# EAGLE design MainBoard 1.3.1 (EAGLE 8.4.1)
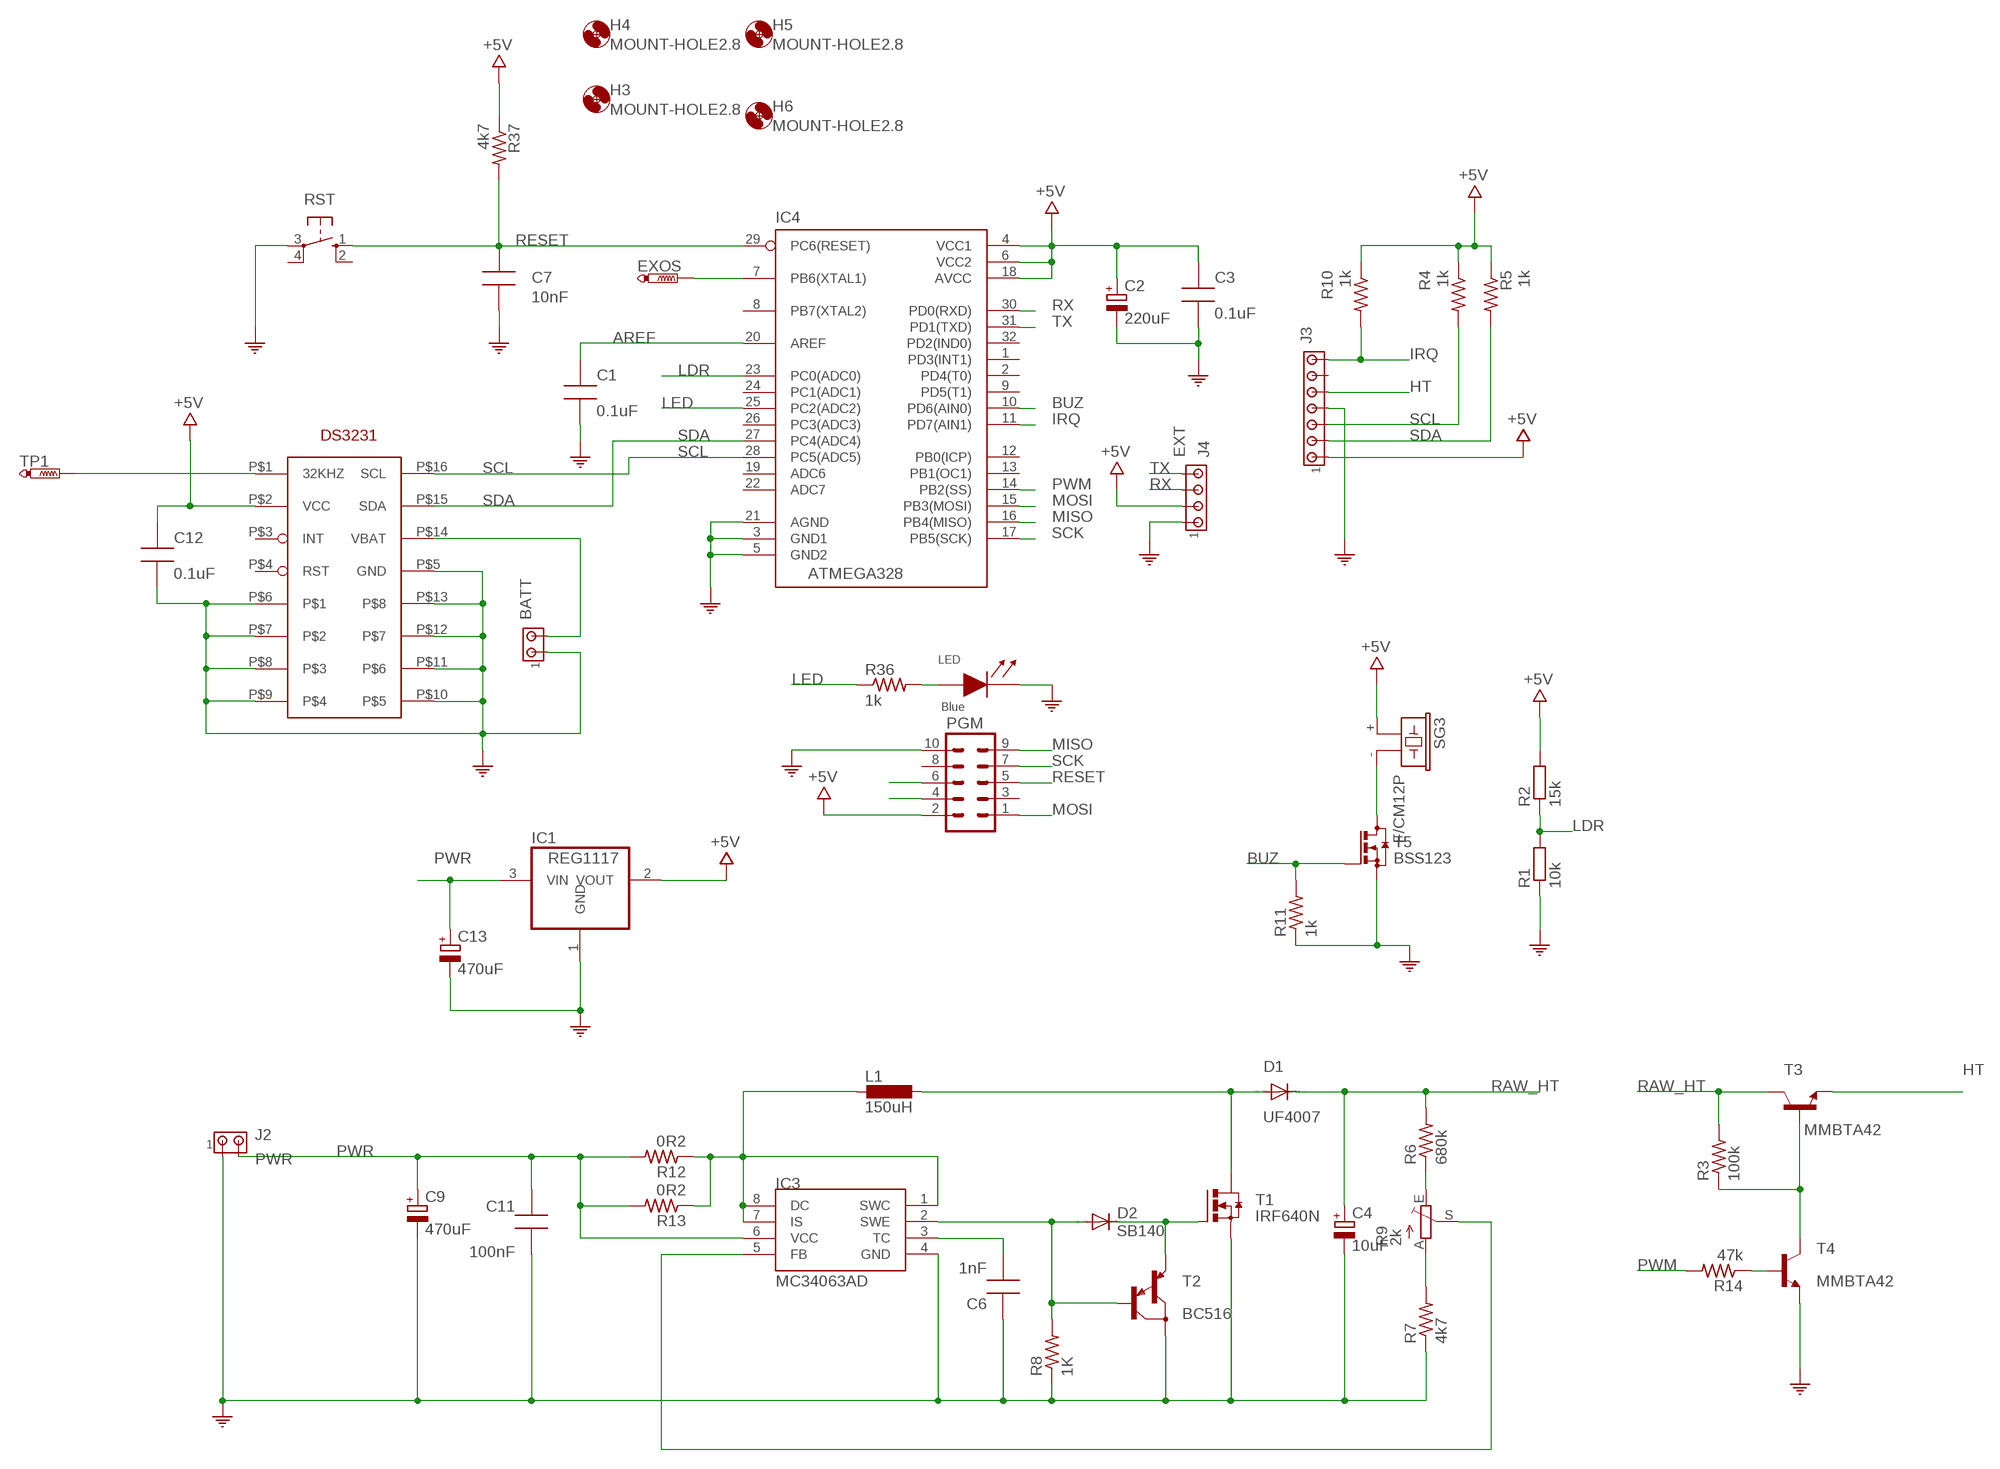
[diagram p0: schematic, sheet 1]

## Parts
BATT  MTA02-100  [10X02MTA]
C1  0.1uF  CAP0805-NP  [CAP0805-NP]
C2  220uF  CPOL-EUSMCD  [SMC_D]
C3  0.1uF  CAP0805-NP  [CAP0805-NP]
C4  10uF  CPOL-EUE3.5-10  [E3,5-10]
C6  1nF  CAP0805-NP  [CAP0805-NP]
C7  10nF  CAP0805-NP  [CAP0805-NP]
C9  470uF  CPOL-EUSMCD  [SMC_D]
C11  100nF  CAP0805-NP  [CAP0805-NP]
C12  0.1uF  CAP0805-NP  [CAP0805-NP]
C13  470uF  CPOL-EUSMCD  [SMC_D]
D1  UF4007  BYT01  [F126-10]
D2  SB140  DIODE-DO07  [DO07]
EXOS  PTR1TP09R  [TP09R]
H3  MOUNT-HOLE2.8  [2,8]
H4  MOUNT-HOLE2.8  [2,8]
H5  MOUNT-HOLE2.8  [2,8]
H6  MOUNT-HOLE2.8  [2,8]
IC1  REG1117  [SOT223]
IC3  MC34063AD  [SOIC8]
IC4  ATMEGA328  ATMEGA168-20AU  [QFP032]
IC5  DS3231SPIC16W  [SOIC-16W]
J2  PWR  MTA02-100  [10X02MTA]
J3  MTA07-100  [10X07MTA]
J4  EXT  MTA04-100  [10X04MTA]
L1  150uH  DO3316P  [D0522P]
LED  Blue  LED0805  [LED0805]
PGM  MA05-2  [MA05-2]
R1  10k  R-EU_M2012  [M2012]
R2  15k  R-EU_0204/2V  [0204V]
R3  100k  R-US_R2012  [R2012]
R4  1k  R-US_M2012  [M2012]
R5  1k  R-US_M2012  [M2012]
R6  680k  R-US_R2012  [R2012]
R7  4k7  R-US_R2012  [R2012]
R8  1K  R-US_R2012  [R2012]
R9  2k  TRIM_EU-B25P  [B25P]
R10  1k  R-US_M2012  [M2012]
R11  1k  R-US_M2012  [M2012]
R12  0R2  R-US_R2010  [R2010]
R13  0R2  R-US_R2010  [R2010]
R14  47k  R-US_R2012  [R2012]
R36  1k  R-US_M2012  [M2012]
R37  4k7  R-US_M2012  [M2012]
RST  10-XX  [B3F-10XX]
SG3  F/CM12P  [F/CM12P]
T1  IRF640N  IRF3704S  [D2PACK]
T2  BC516  [TO92]
T3  MMBTA42  BC846  [SOT23]
T4  MMBTA42  BC846  [SOT23]
T5  BSS123  [SOT23]
TP1  PTR1TP09R  [TP09R]

## Nets
+5V [pwr]: C2.+ C3.1 C12.1 IC1.2(VOUT) IC4.4(VCC1) IC4.6(VCC2) IC4.18(AVCC) IC5.P$2(VCC) J3.1 J4.2 PGM.2 R2.2 R4.1 R5.1 R10.1 R37.1 SG3.+
AREF: C1.1 IC4.20(AREF)
BATT: BATT.2 IC5.P$14(VBAT)
BUZ: IC4.10(PD6(AIN0)) R11.2 T5.1(G)
GND: BATT.1 C1.2 C2.- C3.2 C4.- C6.1 C7.2 C9.- C11.1 C12.2 C13.- IC1.1(GND) IC3.4(GND) IC4.3(GND1) IC4.5(GND2) IC4.21(AGND) IC5.P$5(GND) IC5.P$6 IC5.P$7 IC5.P$8 IC5.P$9 IC5.P$10 IC5.P$11 IC5.P$12 IC5.P$13 J2.1 J3.4 J4.1 LED.1(CA) PGM.10 R1.1 R7.1 R8.1 R11.1 RST.3(P) T1.3(S) T2.3(C) T4.2(E) T5.2(S) ; supply symbol labelled COM
HT: J3.5 T3.2(E)
IRQ: IC4.11(PD7(AIN1)) J3.7 R10.2
LDR: IC4.23(PC0(ADC0)) R1.2 R2.1
LED: IC4.25(PC2(ADC2)) R36.1
MISO: IC4.16(PB4(MISO)) PGM.9
MOSI: IC4.15(PB3(MOSI)) PGM.1
N$1: IC5.P$1(32KHZ) TP1.TP
N$2: D1.A L1.P$2 T1.2(D)
N$3: SG3.- T5.3(D)
N$5: EXOS.TP IC4.7(PB6(XTAL1))
N$6: C6.2 IC3.3(TC)
N$7: R3.1 T3.1(B) T4.3(C)
N$9: R7.2 R9.A
N$10: D2.A IC3.2(SWE) R8.2 T2.2(B)
N$11: R6.1 R9.E
N$15: LED.2(AN) R36.2
N$16: IC3.5(FB) R9.S
N$17: IC3.1(SWC) IC3.7(IS) IC3.8(DC) L1.P$1 R12.1 R13.1
N$19: R14.1 T4.1(B)
N$21: D2.C T1.1(G) T2.1(E)
PWM: IC4.14(PB2(SS)) R14.2
PWR [pwr]: C9.+ C11.2 C13.+ IC1.3(VIN) IC3.6(VCC) J2.2 R12.2 R13.2
RAW_HT: C4.+ D1.C R3.2 R6.2 T3.3(C)
RESET: C7.1 IC4.29(PC6(RESET)) PGM.5 R37.2 RST.1(S)
RX: IC4.30(PD0(RXD)) J4.3 PGM.4
SCK: IC4.17(PB5(SCK)) PGM.7
SCL: IC4.28(PC5(ADC5)) IC5.P$16(SCL) J3.3 R4.2
SDA: IC4.27(PC4(ADC4)) IC5.P$15(SDA) J3.2 R5.2
TX: IC4.31(PD1(TXD)) J4.4 PGM.6
Unconnected: IC4.1(PD3(INT1)) IC4.2(PD4(T0)) IC4.8(PB7(XTAL2)) IC4.9(PD5(T1)) IC4.12(PB0(ICP)) IC4.13(PB1(OC1)) IC4.19(ADC6) IC4.22(ADC7) IC4.24(PC1(ADC1)) IC4.26(PC3(ADC3)) IC4.32(PD2(IND0)) IC5.P$3(INT) IC5.P$4(RST) J3.6 PGM.3 PGM.8 RST.2(S1) RST.4(P1)

## Library data of the parts
BATT J2 = con-amp:MTA02-100: AMP connector
C1 C3 C6 C7 C11 C12 = MySMD:CAP0805-NP
C2 C9 C13 = rcl:CPOL-EU: POLARIZED CAPACITOR, European symbol
C4 = resistor:CPOL-EU: POLARIZED CAPACITOR, European symbol
D1 = diode:BYT01: DIODE ultra fast
D2 = diode:DIODE-: DIODE
EXOS TP1 = testpad:PTR1: TEST PIN
H3-H6 = holes:MOUNT-HOLE: MOUNTING HOLE with drill center marker
IC1 = burr-brown:REG1117: 800mA and 1A Low Dropout (LDO) Positive Regulator 1.8V, 2.5V, 2.85V, 3.3V, 5V, and Adj; MPN: REG1117; OC_FARNELL: 1097566; OC_NEWARK: 14P6981
IC3 = mc34063:MC34063
IC4 = MySMD:ATMEGA168-20AU
IC5 = DS3231:DS3231
J3 = con-amp:MTA07-100: AMP connector
J4 = con-amp:MTA04-100: AMP connector
L1 = inductor-coilcraft:DO3316P: COILCRAFT
LED = MySMD:LED0805
PGM = con-lstb:MA05-2: PIN HEADER; OC_FARNELL: unknown; OC_NEWARK: unknown
R1 R2 = resistor:R-EU_: RESISTOR, European symbol
R3-R8 R10-R14 R36 R37 = adafruit:R-US_: RESISTOR, American symbol
R9 = pot:TRIM_EU-: POTENTIOMETER
RST = switch-omron:10-XX: OMRON SWITCH; MPN: B3F-1000; OC_FARNELL: 176432; OC_NEWARK: 36M3542
SG3 = buzzer:F/CM12P: BUZZER Source: Buerklin; OC_FARNELL: unknown; OC_NEWARK: unknown
T1 = transistor-power:IRF3704: SMPS MOSFET HEXFET® Power MOSFET Source: http://www.irf.com/product-info/datasheets/data/irf3704.pdf
T2 = transistor-pnp:BC516: PNP Darlington Transistor
T3 T4 = transistor:BC846: NPN TRANSISTOR
T5 = transistor-small-signal:BSS123: N-CHANNEL MOS FET

## Module TUBEIN16
Ports: 

### Library data of the parts

## Net classes
0 default: width 0.254 mm, clearance 0.254 mm
1 pwr: width 0.254 mm, clearance 0.356 mm

## Board
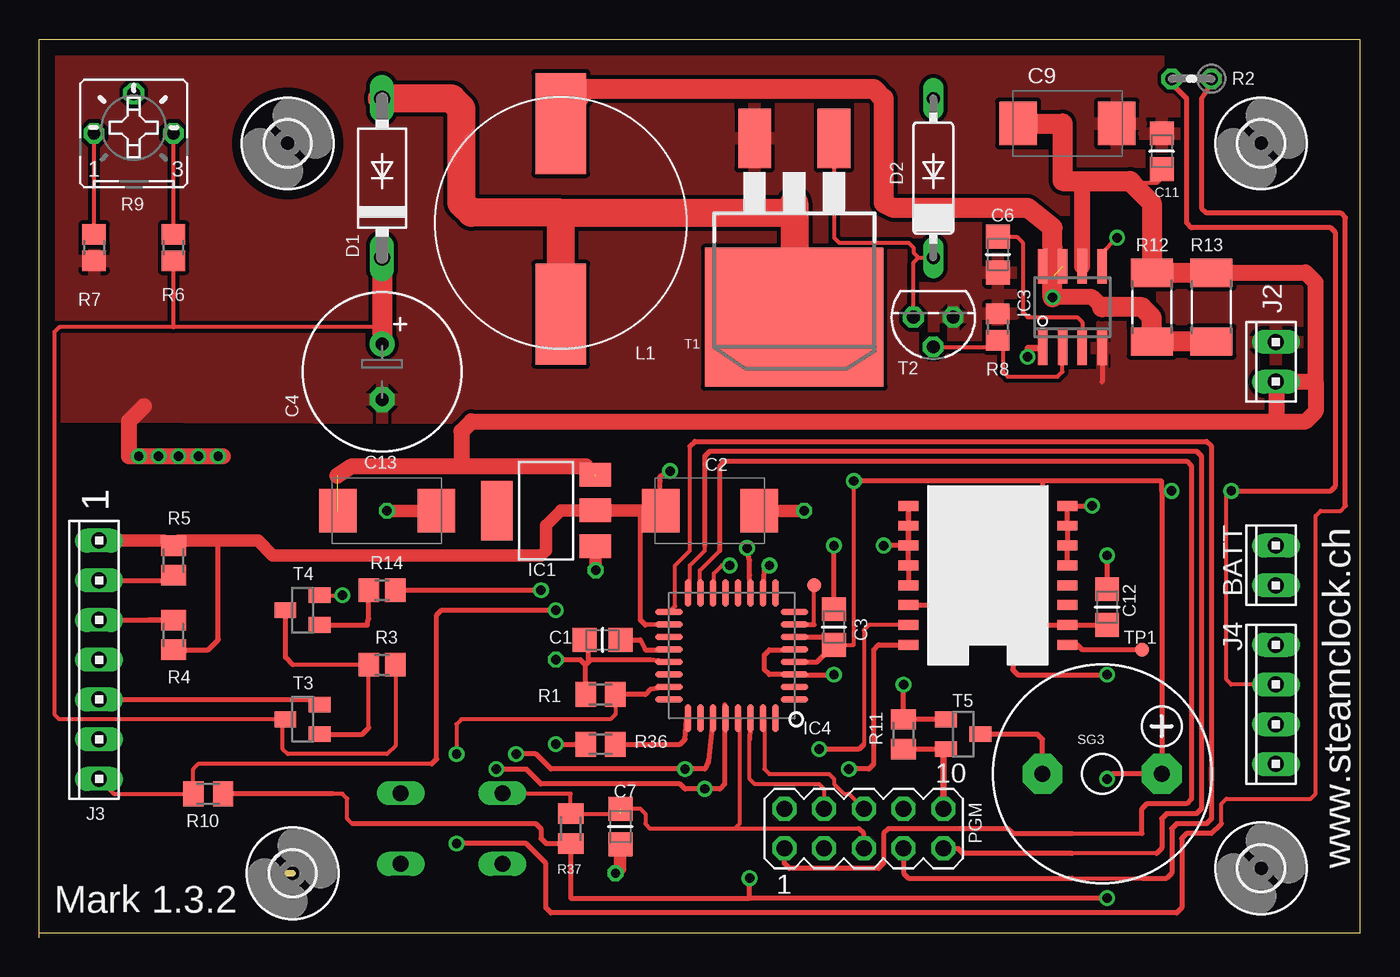
[diagram p1: board, top side]
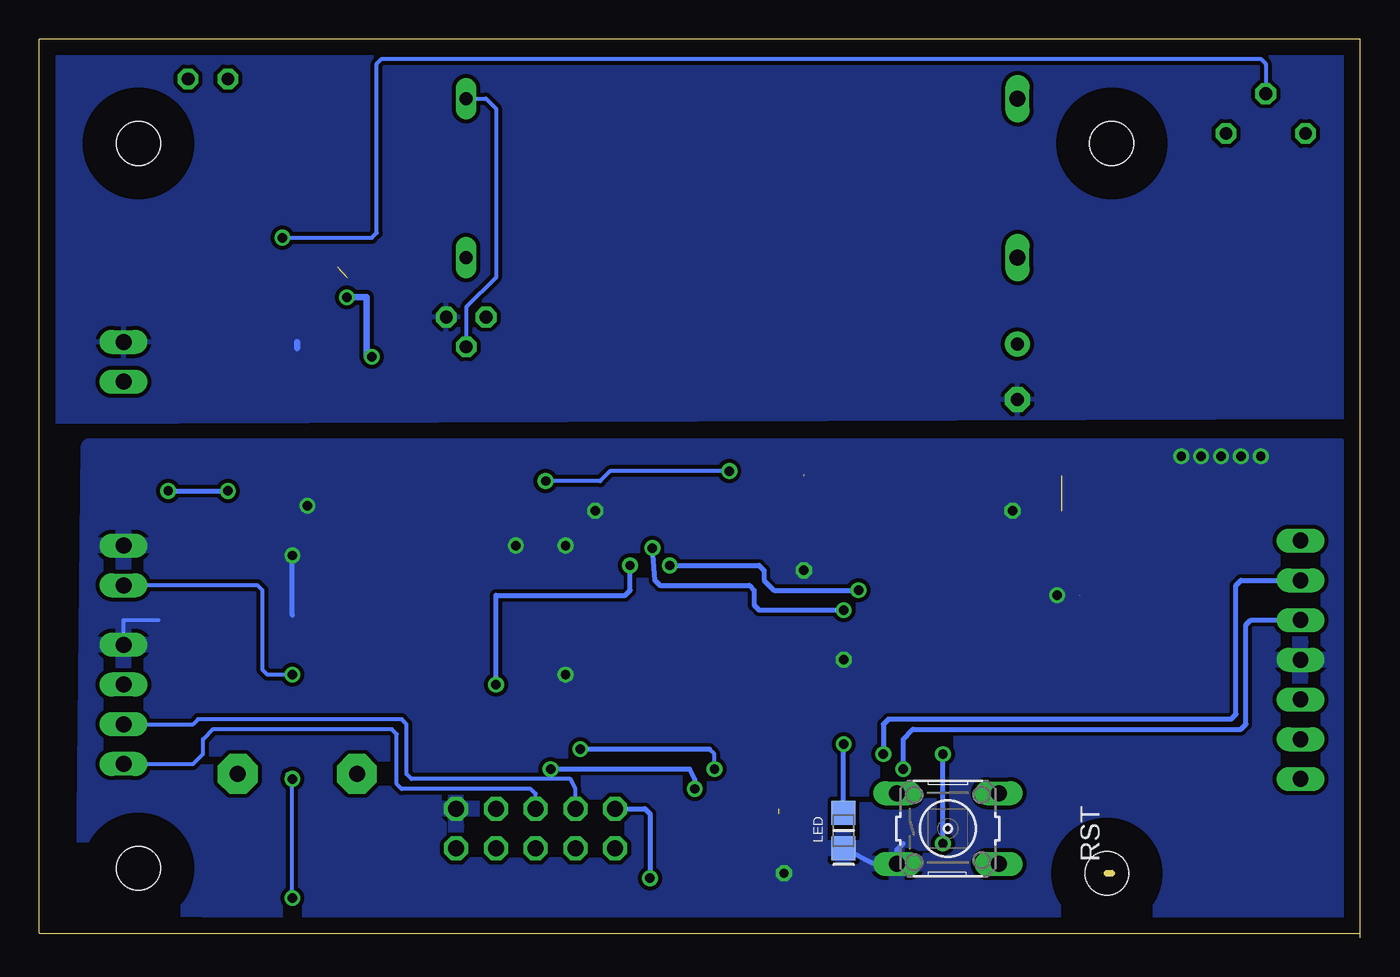
[diagram p2: board, bottom side, seen from below]

Size 84.47 x 57.47 mm. Coordinates in mm from the lower left corner, seen from the top.
Outline: 84.45,0.32 84.45,57.46
Outline: 84.45,0.3 0.02,0.3
Outline: 0,0 0,57.46
Outline: 16.21,4.13 15.89,4.13
Outline: 0.02,57.47 84.47,57.47
Copper layers (1*16): Top 0.035mm / dielectric 1.5mm / Bottom 0.035mm
Design rules "default": minimum track width 10mil, minimum drill 24mil, track to track 8mil, track to pad 8mil, pad to pad 8mil, via to via 8mil, smd to smd 8mil, copper to edge 40mil, drill to drill 8mil, minimum pad ring 10mil, minimum via ring 8mil, stop-mask expansion 4mil, vias tented up to drill 0mil, thermal gap 10mil

### Footprints (pad centres in the part's own frame; a part is rotated, then mirrored left to right if it is on the bottom)
10X02MTA = drill 1.016 long: 1 1.27,0; 2 -1.27,0
CAP0805-NP = smd 1.524 x 1.524: 1 0,0; 2 2.286,0
SMC_D = smd 2.4 x 2.8: + -3.15,0; - 3.15,0
E3,5-10 = drill 0.813 pad 1.6: + -1.778,0 | drill 0.813 pad 1.6 octagon: - 1.778,0
F126-10 = drill 1.016 long: A 5.08,0; C -5.08,0
DO07 = drill 0.813 long: A 5.08,0; C -5.08,0
TP09R = smd 0.9 x 0.9: TP 0,0
2,8 = hole 2.8: 0,0
SOT223 = smd 1.499 x 2.007: 1 -2.261,-3.15; 2 0.025,-3.15; 3 2.311,-3.15 | smd 3.81 x 2.007: 4 0,3.15
SOIC8 = smd 0.6 x 2.2: 1 -1.905,-2.6; 2 -0.635,-2.6; 3 0.635,-2.6; 4 1.905,-2.6; 5 1.905,2.6; 6 0.635,2.6; 7 -0.635,2.6; 8 -1.905,2.6
QFP032 = smd 0.432 x 1.778: 1 0,0; 2 0.8,0; 3 1.599,0; 4 2.399,0; 5 3.199,0; 6 3.998,0; 7 4.798,0; 8 5.598,0; 17 5.588,8.001; 18 4.798,7.997; 19 3.998,7.997; 20 3.199,7.997; 21 2.399,7.997; 22 1.599,7.997; 23 0.799,7.997; 24 0,7.997 | smd 1.778 x 0.432: 9 6.807,1.194; 10 6.807,2.007; 11 6.807,2.794; 12 6.807,3.607; 13 6.807,4.394; 14 6.807,5.182; 15 6.807,5.994; 16 6.816,6.803; 25 -1.194,6.807; 26 -1.194,5.994; 27 -1.194,5.182; 28 -1.194,4.394; 29 -1.194,3.607; 30 -1.194,2.794; 31 -1.194,2.007; 32 -1.194,1.194
SOIC-16W = smd 0.635 x 1.27: P$1 -16.51,-1.27; P$2 -15.24,-1.27; P$3 -13.97,-1.27; P$4 -12.7,-1.27; P$5 -11.43,-1.27; P$6 -10.16,-1.27; P$7 -8.89,-1.27; P$8 -7.62,-1.27; P$9 -7.62,8.89; P$10 -8.89,8.89; P$11 -10.16,8.89; P$12 -11.43,8.89; P$13 -12.7,8.89; P$14 -13.97,8.89; P$15 -15.24,8.89; P$16 -16.51,8.89
10X07MTA = drill 1.016 long: 1 7.62,0; 2 5.08,0; 3 2.54,0; 4 0,0; 5 -2.54,0; 6 -5.08,0; 7 -7.62,0
10X04MTA = drill 1.016 long: 1 3.81,0; 2 1.27,0; 3 -1.27,0; 4 -3.81,0
D0522P = smd 3.251 x 6.452: P$1 0,6.35; P$2 0,-5.842
LED0805 = smd 1.524 x 1.524: 1 0,0; 2 2.286,0
MA05-2 = drill 1.016 octagon: 1 -5.08,-1.27; 2 -5.08,1.27; 3 -2.54,-1.27; 4 -2.54,1.27; 5 0,-1.27; 6 0,1.27; 7 2.54,-1.27; 8 2.54,1.27; 9 5.08,-1.27; 10 5.08,1.27
M2012 = smd 1.3 x 1.6: 1 -0.95,0; 2 0.95,0
0204V = drill 0.813 octagon: 1 -1.27,0; 2 1.27,0
R2012 = smd 1.3 x 1.5: 1 -0.85,0; 2 0.85,0
B25P = drill 0.813 octagon: A -2.54,0; E 2.54,0; S 0,2.54
R2010 = smd 1.8 x 2.7: 1 -2.2,0; 2 2.2,0
B3F-10XX = drill 1.016 long: 1 -3.251,2.261; 2 3.251,2.261; 3 -3.251,-2.261; 4 3.251,-2.261
F/CM12P = drill 1.016 pad 2.54 octagon: + 3.81,0; - -3.81,0
D2PACK = smd 2.083 x 3.81: 1 -2.54,-8.89; 3 2.54,-8.89 | smd 11.43 x 8.89: 2 0,2.54
TO92 = drill 0.813 octagon: 1 1.27,0; 2 0,1.905; 3 -1.27,0
SOT23 = smd 1 x 1.4: 1 -0.95,-1.1; 2 0.95,-1.1; 3 0,1.1

### Placement (x,y rotation side)
BATT  79.08,23.81 90 top
C1  37.17,19.05 180 top
C2  42.88,27.3 0 top
C3  50.82,18.73 90 top
C4  21.93,36.2 270 top
C6  61.3,42.55 90 top
C7  37.17,8.26 270 top
C9  65.74,52.07 0 top
C11  71.77,51.44 270 top
C12  68.28,20 90 top
C13  22.25,27.3 0 top
D1  21.93,48.58 90 top
D2  57.17,48.58 90 top
EXOS  49.55,22.54 0 top
H3  15.89,50.8 0 top
H4  16.21,4.13 0 top
H5  78.12,4.45 0 top
H6  78.12,50.8 0 top
IC1  32.41,27.3 90 top
IC3  66.06,40.32 0 top
IC4  48.28,15.24 90 top
IC5  64.47,35.24 90 top
J2  79.08,36.83 90 top
J3  3.83,17.78 90 top
J4  79.08,14.92 90 top
L1  33.36,45.72 0 top
LED  33.04,5.71 90 bottom
PGM  52.73,6.99 0 top
R1  35.9,15.56 0 top
R2  73.68,54.93 180 top
R3  21.93,17.46 0 top
R4  8.59,19.37 90 top
R5  8.59,24.13 270 top
R6  8.59,44.13 270 top
R7  3.51,44.13 90 top
R8  61.3,39.05 270 top
R9  6.05,51.44 0 top
R10  10.81,9.21 180 top
R11  55.27,13.02 90 top
R12  71.14,40.32 90 top
R13  74.95,40.32 90 top
R14  21.93,22.22 0 top
R36  35.9,12.38 180 top
R37  33.99,6.99 90 top
RST  26.37,6.99 0 bottom
SG3  67.96,10.48 0 top
T1  48.28,42.23 180 top
T2  57.17,39.69 180 top
T3  16.85,13.97 90 top
T4  16.85,20.95 90 top
T5  59.08,13.02 270 top
TP1  70.5,18.41 180 top

### Tracks (layer width: path | path; a pad name or v marks a point on that pad's centre or on a via)
+5V  (via drill 0.6)
  Top 0.254: C3.1 52.09,18.73 v52.09,29.21 | 20.02,7.3 19.7,7.62 19.7,8.89 19.39,9.21 18.75,9.21 | J4.2 76.22,16.19 75.9,16.51 75.9,28.26 v76.22,28.58
  Top 0.305: 47.99,19.21 IC4.6 50.31,19.24 C3.1 49.73,17.64 IC4.4 | 64.16,29.21 64.16,20.32 64.47,20 IC5.P$2 C12.1 | 64.16,29.21 71.77,29.21 71.77,28.58 | 64.16,29.21 v52.09,29.21 | v68.28,2.54 45.42,2.54 | C2.+ 39.71,29.21 39.71,29.53 v40.34,29.84 | IC4.18 38.76,20 38.44,20.32 38.44,26.67 38.43,27.28 | 71.77,28.58 SG3.+ 68.6,10.48 v68.28,10.16 | v72.41,28.58 71.77,28.58 | 45.42,2.54 v45.42,3.81 | 45.42,2.54 33.99,2.54 R37.1 32.41,6.03 32.09,6.35 32.09,6.99 31.77,7.3 20.02,7.3 | 18.75,9.21 R10.1 | R2.2 72.41,54.61 73.36,53.66 73.36,45.72 73.68,45.4 82.57,45.4 82.89,45.08 82.89,28.89 82.57,28.58 v76.22,28.58 | 7.96,25.4 8.28,25.08 R5.1 | R4.1 10.81,18.42 11.45,19.05 11.45,25.4
  Top 0.406: 37.49,27.28 38.43,27.28 C2.+ | 35.53,27.31 IC1.2 | 8.28,18.42 8.27,18.42 R4.1
  Top 0.813: C2.+ 39.73,27.33 IC1.2 33.38,27.33 32.41,26.35 32.41,24.77 32.09,24.45 14.94,24.45 13.99,25.4 11.45,25.4 8.91,25.4 R5.1 | J3.1 7.96,25.4
  Bottom 0.254: v40.34,29.84 47.96,29.84 48.6,29.21 v52.09,29.21 | v68.28,2.54 v68.28,10.16 68.6,10.48
  Bottom 0.305: v76.22,28.58 v72.41,28.58 | PGM.2 45.74,8.26 45.42,7.94 v45.42,3.81
AREF
  Top 0.305: C1.1 38.44,19.05 38.76,18.42 40.26,18.42 IC4.20
BATT  (via drill 0.6)
  Top 0.305: IC5.P$14 61.93,21.27 62.25,20.95 62.25,17.15 62.57,16.83 v68.28,16.83
  Bottom 0.254: v68.28,16.83 69.87,16.83 70.19,17.15 70.19,22.22 70.5,22.54 BATT.2
BUZ  (via drill 0.6)
  Top 0.305: IC4.10 46.38,23.49 v46.69,23.81 | T5.1 R11.2 v55.27,16.19
  Bottom 0.305: v55.27,16.19 55.27,21.91 47.01,21.91 46.69,22.22 v46.69,23.81
GND  (via drill 0.6)  (1 unrouted)
  Top 0.254: C7.2 37.13,5.97 37.13,5.67 | 17.8,21.91 T4.2 | T4.2 v19.39,21.91
  Top 0.305: IC5.P$13 IC5.P$12 IC5.P$11 | IC5.P$11 IC5.P$10 IC5.P$9 IC5.P$11 | IC4.5 48.26,18.42 46.69,18.42 46.38,18.1 46.38,17.15 46.68,16.84 IC4.3 48.29,16.83 v50.82,16.83 | IC5.P$5 IC5.P$6 IC5.P$7 IC5.P$8 v67.33,27.62 | C3.2 v50.82,25.08 | IC5.P$11 v54,25.08 | C12.2 v68.28,24.45 | 34.63,15.24 R1.1 34.95,17.46 | IC4.21 39.07,17.78 35.26,17.78 35.1,17.62 | 35.1,17.62 34.95,17.46 | R11.1 T5.2 | C1.2 35.1,18.83 35.1,17.62 | 34.95,17.46 34.63,17.78 v33.04,17.78 | IC3.4 67.96,35.56
  Top 0.406: T5.2 57.8,12.07 PGM.10 | 18.12,21.9 T4.2
  Top 0.813: 25.42,26.96 C13.- | C13.- 25.42,27.31 | C13.- v22.25,27.31 | IC1.1 35.58,25.04 v35.58,23.49 | C2.- v48.92,27.31 | 37.13,5.67 37.13,4.4 v36.85,4.13
  Top 1.016: 6.69,33.97 5.73,33.02 5.73,30.8 v6.37,30.8 v7.64,30.8 v8.91,30.8 v10.18,30.8 v11.45,30.8 11.77,30.8
  Bottom 0.254: J4.1 79.08,20.32 76.85,20.32
  Bottom 0.305: LED.1 31.1,4.72 RST.3 29.62,5.64 29.23,6.03 | 68.28,20.64 v68.28,24.45
  Bottom 0.406: 67.96,38.1 IC3.4
  pour Top: 0.97,56.83 0.97,33.34 83.84,33.02 83.84,56.2
  pour Bottom: 1.29,31.43 0.97,1.27 5.73,0.64 81.62,1.9 81.3,31.43
  pour Bottom (rank 6): 0.66,57.15 83.84,57.15 83.84,33.02 0.97,33.34
HT
  Top 0.305: J3.5 17.48,15.24 17.8,14.92 T3.2
IRQ  (via drill 0.6)
  Top 0.254: 25.1,11.11 10.18,11.11 9.87,10.8 R10.2 4.78,9.21 J3.7
  Top 0.305: 4.15,9.84 J3.7 | IC4.11 45.42,23.18 45.42,24.13 v45.26,24.92 | v33.04,20.95 25.74,20.95 25.42,20.64 25.42,11.43 25.1,11.11
  Top 0.406: J3.7 4.15,9.84
  Bottom 0.305: v45.26,24.92 45.11,22.86 44.79,22.54 39.07,22.54 38.76,22.22 38.76,21.27 38.44,20.95 v33.04,20.95
LDR  (via drill 0.6)
  Top 0.254: R1.2 36.85,14.29 36.53,13.97 27.01,13.97 26.69,13.65 v26.69,11.75 | 75.58,7.3 75.58,8.57 75.9,8.89 81.3,8.89 81.62,9.21 81.62,26.99 81.94,27.31 83.2,27.31 83.52,27.62
  Top 0.305: 75.58,7.3 74.95,6.67 73.36,6.67 73.05,6.35 73.05,1.9 72.73,1.59 32.72,1.59 32.41,1.9 32.41,4.76 31.13,6.03 v26.69,6.03 | IC4.23 39.07,15.87 38.76,15.56 R1.2 | R2.1 74.95,54.61 74.31,53.66 74.31,46.67 74.63,46.36 83.2,46.36 83.52,46.04 83.52,27.62
  Bottom 0.305: v26.69,6.03 v26.69,11.75
LED
  Top 0.305: IC4.25 41.4,13.97 41.3,12.7 40.98,12.38 R36.1
MISO
  Top 0.254: IC4.16 41.61,22.19 41.61,23.81 42.57,24.77 42.57,25.08 | 71.46,5.4 66.06,5.4
  Top 0.305: 42.57,25.08 42.57,30.8 42.88,31.11 74,31.11 74.31,30.8 74.31,8.26 74,7.94 72.09,7.94 71.77,7.62 71.77,5.71 71.46,5.4 | PGM.9 58.76,5.71 59.08,5.4 66.06,5.4
MOSI
  Top 0.254: IC4.15 42.25,22.09 42.25,23.49 43.52,24.77 | 66.06,6.67 70.5,6.67
  Top 0.305: 43.52,24.77 43.52,30.16 43.84,30.48 73.36,30.48 73.68,30.16 73.68,8.89 73.36,8.57 70.82,8.57 70.5,8.26 70.5,6.67 | PGM.1 47.65,4.76 47.96,4.45 53.68,4.45 54,4.76 54,6.67 54.31,6.99 61.93,6.99 62.25,6.67 66.06,6.67
N$1
  Top 0.305: TP1.TP 66.69,18.42 66.38,18.73 IC5.P$1
N$2
  Top 1.778: 32.91,40.64 L1.P$2 33.36,46.36 | 33.36,46.36 27.64,46.36 27.01,46.99 27.01,53.02 26.37,53.66 D1.A | 33.36,46.36 47.96,46.36 48.28,46.99 T1.2
N$3
  Top 0.305: SG3.- 64.16,12.7 63.84,13.02 T5.3
N$5
  Top 0.254: 49.55,20.04 EXOS.TP
  Top 0.305: IC4.7 49.55,20.04
N$6
  Top 0.254: C6.2 62.5,44.83 62.89,44.45 62.89,40.01 63.2,39.69 66.38,39.69 66.69,39.37 IC3.3
N$7
  Top 0.254: 16.21,17.46 R3.1 21.08,13.44
  Top 0.305: 16.21,17.46 15.75,17.93 T4.3 | T3.1 18.27,13.02 20.66,13.02 21.08,13.44
N$9
  Top 0.254: R7.2 R9.A
N$10
  Top 0.254: T2.2 60.88,37.78 R8.2 61.62,37.89 61.62,36.19 61.93,35.88 65.11,35.88 65.42,36.19 IC3.2
  Bottom 0.254: D2.A 55.9,53.66 55.27,53.02 55.27,42.23 57.17,40.32 T2.2
N$11
  Top 0.254: R6.1 R9.E
N$15  (via drill 0.6)
  Top 0.305: v33.04,12.38 34.31,12.38 R36.2
  Bottom 0.305: LED.2 v33.04,12.38
N$16  (via drill 0.6)
  Top 0.254: IC3.5 67.96,43.82 v68.92,44.77
  Bottom 0.254: v68.92,44.77 63.2,44.77 62.89,45.08 62.89,55.88 62.57,56.2 6.37,56.2 6.05,55.88 R9.S
N$17  (via drill 0.6)  (1 unrouted)
  Top 0.406: IC3.1 63.2,37.72 v63.2,37.15
  Top 0.61: IC3.7 IC3.8 64.79,43.18
  Top 1.016: 64.79,43.18 64.79,44.13 | 67.96,40.32 67.33,40.96 v64.79,40.96
  Top 1.27: 64.79,44.13 64.79,45.4 63.2,46.67 54.63,46.67 54,46.99 54,53.66 53.36,54.29 34.95,54.29 L1.P$1 | 67.96,40.32 70.5,40.32 71.14,39.69 R12.1 R13.1 | v64.79,40.96 64.79,42.23
  Bottom 0.406: v63.2,37.15 63.52,37.15 63.52,40.96 v64.79,40.96
N$19
  Top 0.305: T4.1 18.27,20 20.97,20 21.08,20.42 R14.1
N$21
  Top 0.254: T2.1 55.9,43.18 56.22,43.5 | 56.22,43.5 D2.C | T1.1 50.82,44.77 51.14,44.45 55.58,44.45 55.9,44.13 55.9,43.82 56.22,43.5
PWM  (via drill 0.6)
  Top 0.254: IC4.14 43.14,22.09 43.14,23.3 43.64,23.81 v44.15,23.81
  Top 0.305: v32.09,22.22 R14.2
  Bottom 0.305: v32.09,22.22 37.49,22.22 38.12,22.86 38.12,23.49 38.44,23.81 v44.15,23.81
PWR  (2 unrouted)
  Top 0.254: C11.2 71.77,48.58 71.46,48.26 69.87,48.26 66.69,48.26 | 71.14,42.54 75.27,42.54
  Top 0.406: 79.1,35.56 J2.2
  Top 0.813: 34.95,30.16 35.58,29.84 35.58,29.53
  Top 1.016: IC3.6 66.69,48.26 65.42,48.39 | 75.27,42.54 80.98,42.54 81.62,41.91 81.62,35.56 | 81.62,35.56 81.62,33.65 80.98,33.02 27.64,33.02 27.01,32.39 27.01,30.16 | 27.01,30.16 34.95,30.16 | 27.01,30.16 20.02,30.16 19.07,29.55 | 79.1,35.56 79.1,33.15 | J2.2 81.62,35.56
  Top 1.27: R13.2 R12.2 71.14,42.54 71.14,46.99 69.87,48.26 69.74,48.39 65.42,48.39 65.42,52.07 C9.+
RAW_HT
  Top 0.254: C4.+ 21.8,39.05 8.59,39.05 | 8.59,39.05 R6.2 | 8.59,39.05 1.29,39.05 0.97,38.73 0.97,14.29 1.29,13.97 15.58,13.97 | 15.58,13.97 T3.3 | R3.2 22.78,12.28 22.25,11.75 15.89,11.75 15.58,12.07 15.58,13.97
  Top 1.27: D1.C C4.+
RESET  (1 unrouted)
  Top 0.254: RST.1 29.62,9.21 33.99,9.21 R37.2 37.17,7.93 | IC4.29 44.79,14.05 44.79,7.3 44.47,6.99 | C7.1 38.44,8.26 38.76,7.94 38.76,7.3 39.07,6.99 44.47,6.99 | 52.41,6.99 44.47,6.99
  Top 0.305: 44.67,13.65 IC4.29 | 29.55,9.32 RST.1 | PGM.5 52.73,6.67 52.41,6.99
RX
  Top 0.254: 45.42,12.7 45.42,10.16 45.74,9.84 49.87,9.84 50.19,9.52 PGM.4
  Top 0.305: IC4.30 45.42,12.7
  Bottom 0.254: J4.3 74.63,13.65 74.31,13.97 61.3,13.97 60.98,13.65 60.98,10.48 60.66,10.16 50.5,10.16 50.19,9.52 PGM.4
SCK
  Top 0.254: 41.61,31.43 41.61,24.77 40.66,23.81 40.66,21.21 IC4.17 | 66.06,3.81 70.5,3.81
  Top 0.305: 41.61,31.43 41.93,31.75 74.63,31.75 74.95,31.43 74.95,7.62 74.63,7.3 72.73,7.3 72.41,6.99 72.41,4.13 72.09,3.81 70.5,3.81 | PGM.7 55.27,4.13 55.58,3.81 66.06,3.81
SCL  (via drill 0.6)
  Top 0.305: J3.3 7,20.32 R4.2 7.01,20.32 | 43.84,14.92 43.84,14.1 | 43.84,14.1 IC4.28 | v29.23,10.79 31.13,10.79 32.09,9.84 40.98,9.84 41.3,9.52 v42.57,9.52 43.52,9.52 43.84,9.84 43.84,14.1 | v51.77,10.79 53.04,10.79 53.36,11.11 53.36,18.42 53.68,18.73 IC5.P$16
  Bottom 0.305: J3.3 7,20.32 7.32,20 7.32,13.65 7.64,13.34 28.59,13.34 29.23,12.7 v29.23,10.79 | v51.77,10.79 42.88,10.79 42.57,10.16 v42.57,9.52
SDA  (via drill 0.6)
  Top 0.254: IC5.P$15 53.04,20 52.73,19.68 52.73,12.38
  Top 0.305: J3.2 8.27,22.86 R5.2 | IC4.27 42.78,11.33 42.57,10.79 v41.3,10.79 32.72,10.79 31.77,11.75 v30.5,11.75 | 52.73,12.38 52.41,12.07 v49.87,12.07
  Bottom 0.254: v41.3,10.79 41.3,11.75 41.61,12.07
  Bottom 0.305: J3.2 7.64,22.86 7.96,22.54 7.96,14.29 8.28,13.97 30.18,13.97 30.5,13.65 v30.5,11.75 | 41.61,12.07 v49.87,12.07
TX
  Top 0.254: IC4.31 46.38,13.94 46.38,10.79 46.69,10.48 50.5,10.48 50.82,10.16 50.82,9.84 51.46,9.21 51.77,9.21 PGM.6
  Bottom 0.254: J4.4 74.63,11.11 74,11.75 74,12.7 73.36,13.34 61.93,13.34 61.62,13.02 61.62,9.84 61.3,9.52 53.04,9.52 52.73,9.21 PGM.6

### Text on the board
tNames: 1 | www.steamclock.ch | Mark 1.3.2